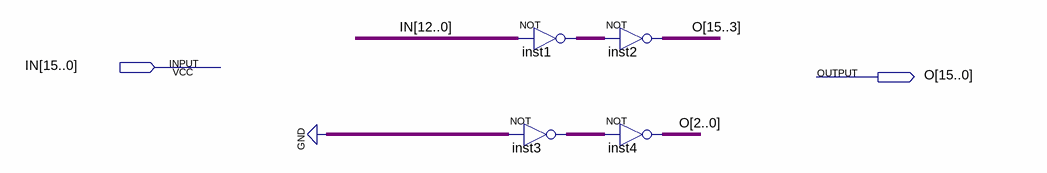
[diagram p0: schematic sheet]
// Quartus schematic SHIFT3.bdf as structural Verilog: 4 symbols, 2 pins
module SHIFT3 (
  input  [15:0] IN,
  output [15:0] O
);

  wire [2:0] inst3_out;
  wire [12:0] inst1_out;

  assign inst1_out = ~IN[12:0];  // NOT inst1, 13 bits wide
  assign inst3_out = ~3'b000;  // NOT inst3, 3 bits wide
  assign O[15:3] = ~inst1_out;  // NOT inst2, 13 bits wide
  assign O[2:0] = ~inst3_out;  // NOT inst4, 3 bits wide
endmodule
